# EAGLE schematic fdcanusb (EAGLE 6.5.0)
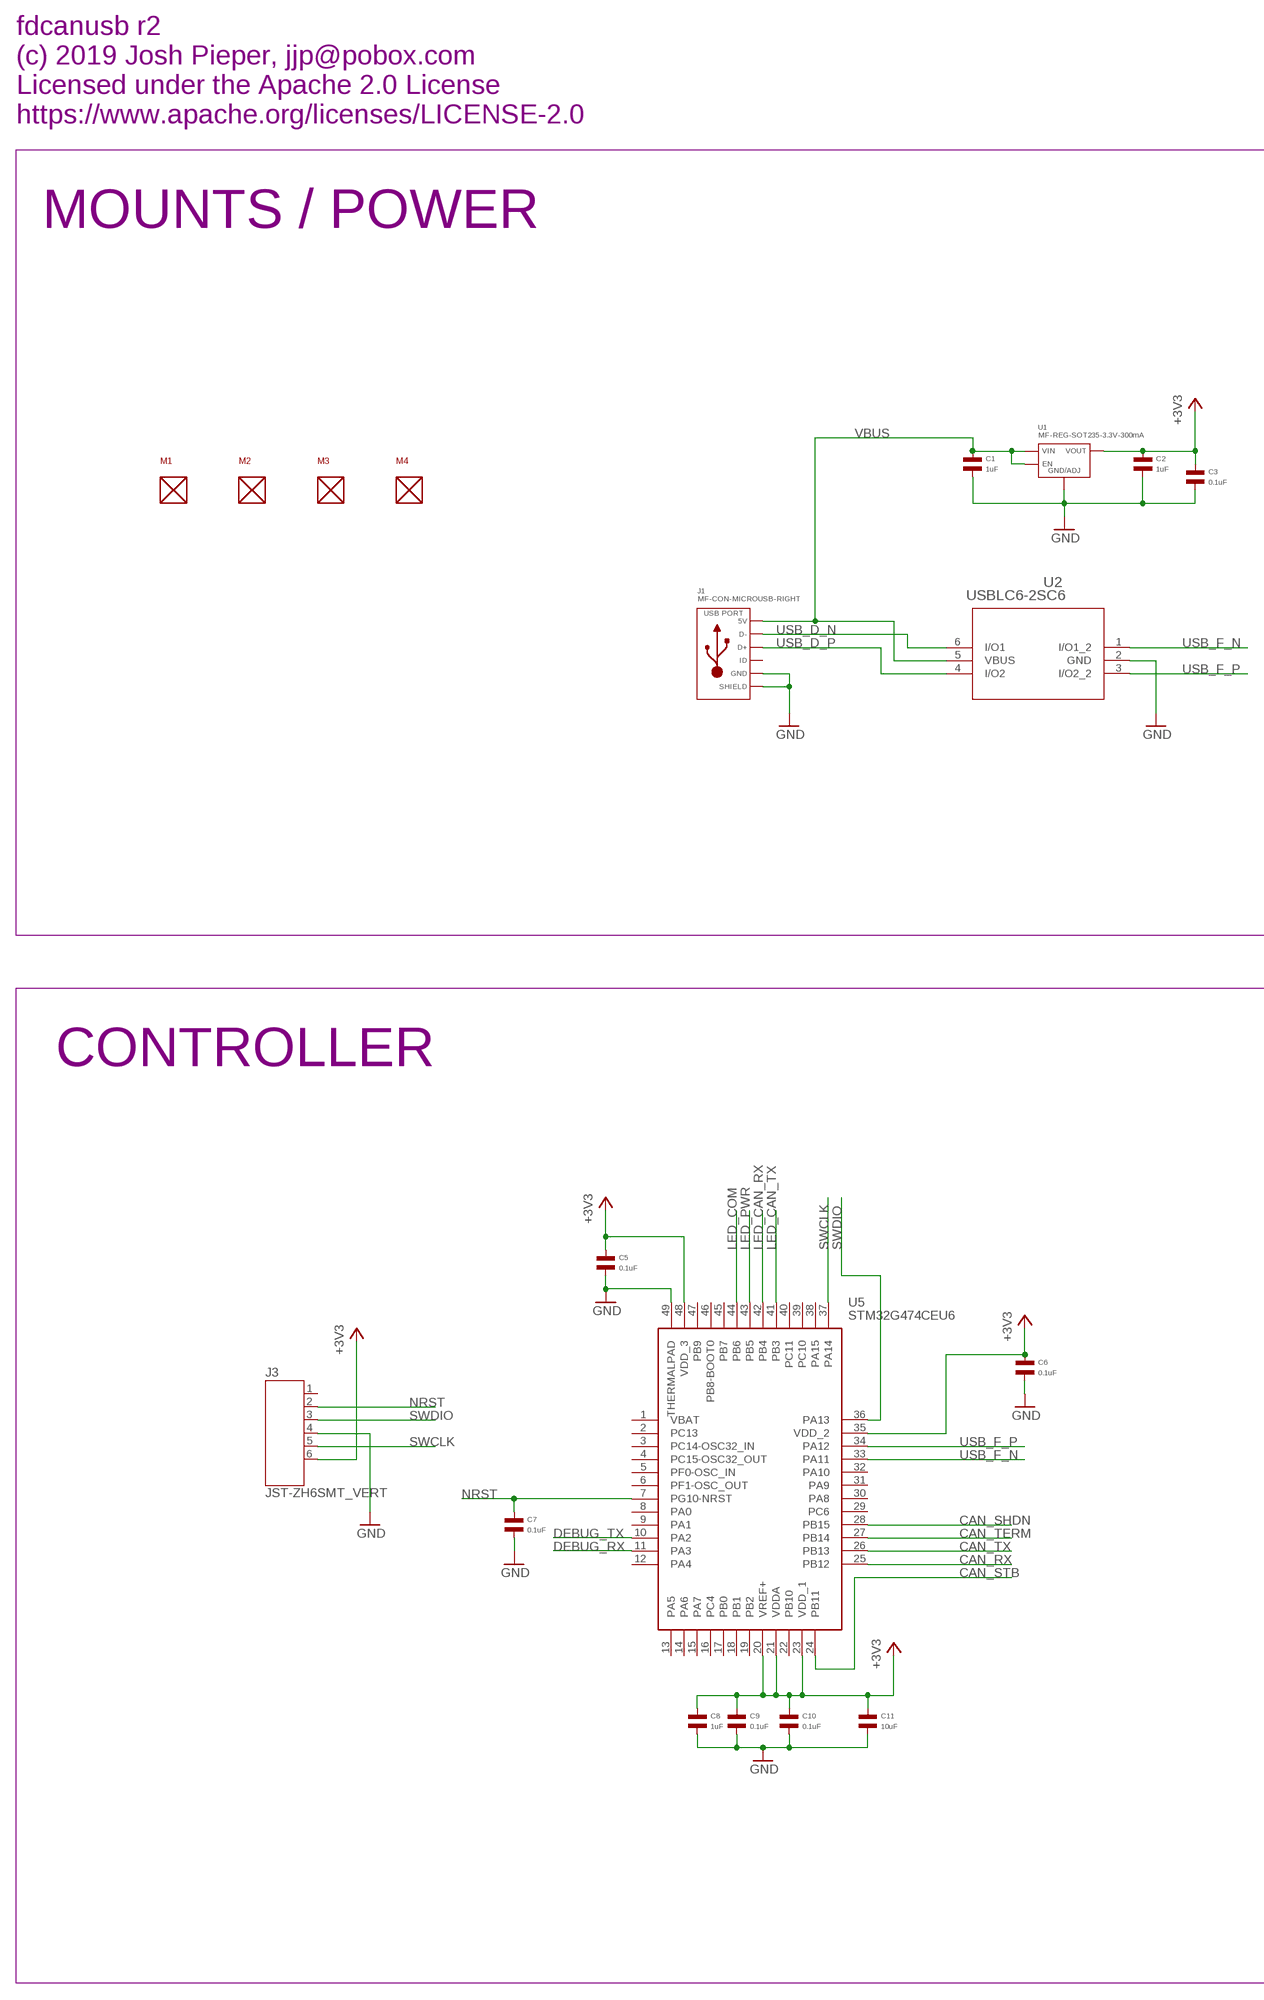
[diagram p0: schematic, sheet 1, part 1 of 2]
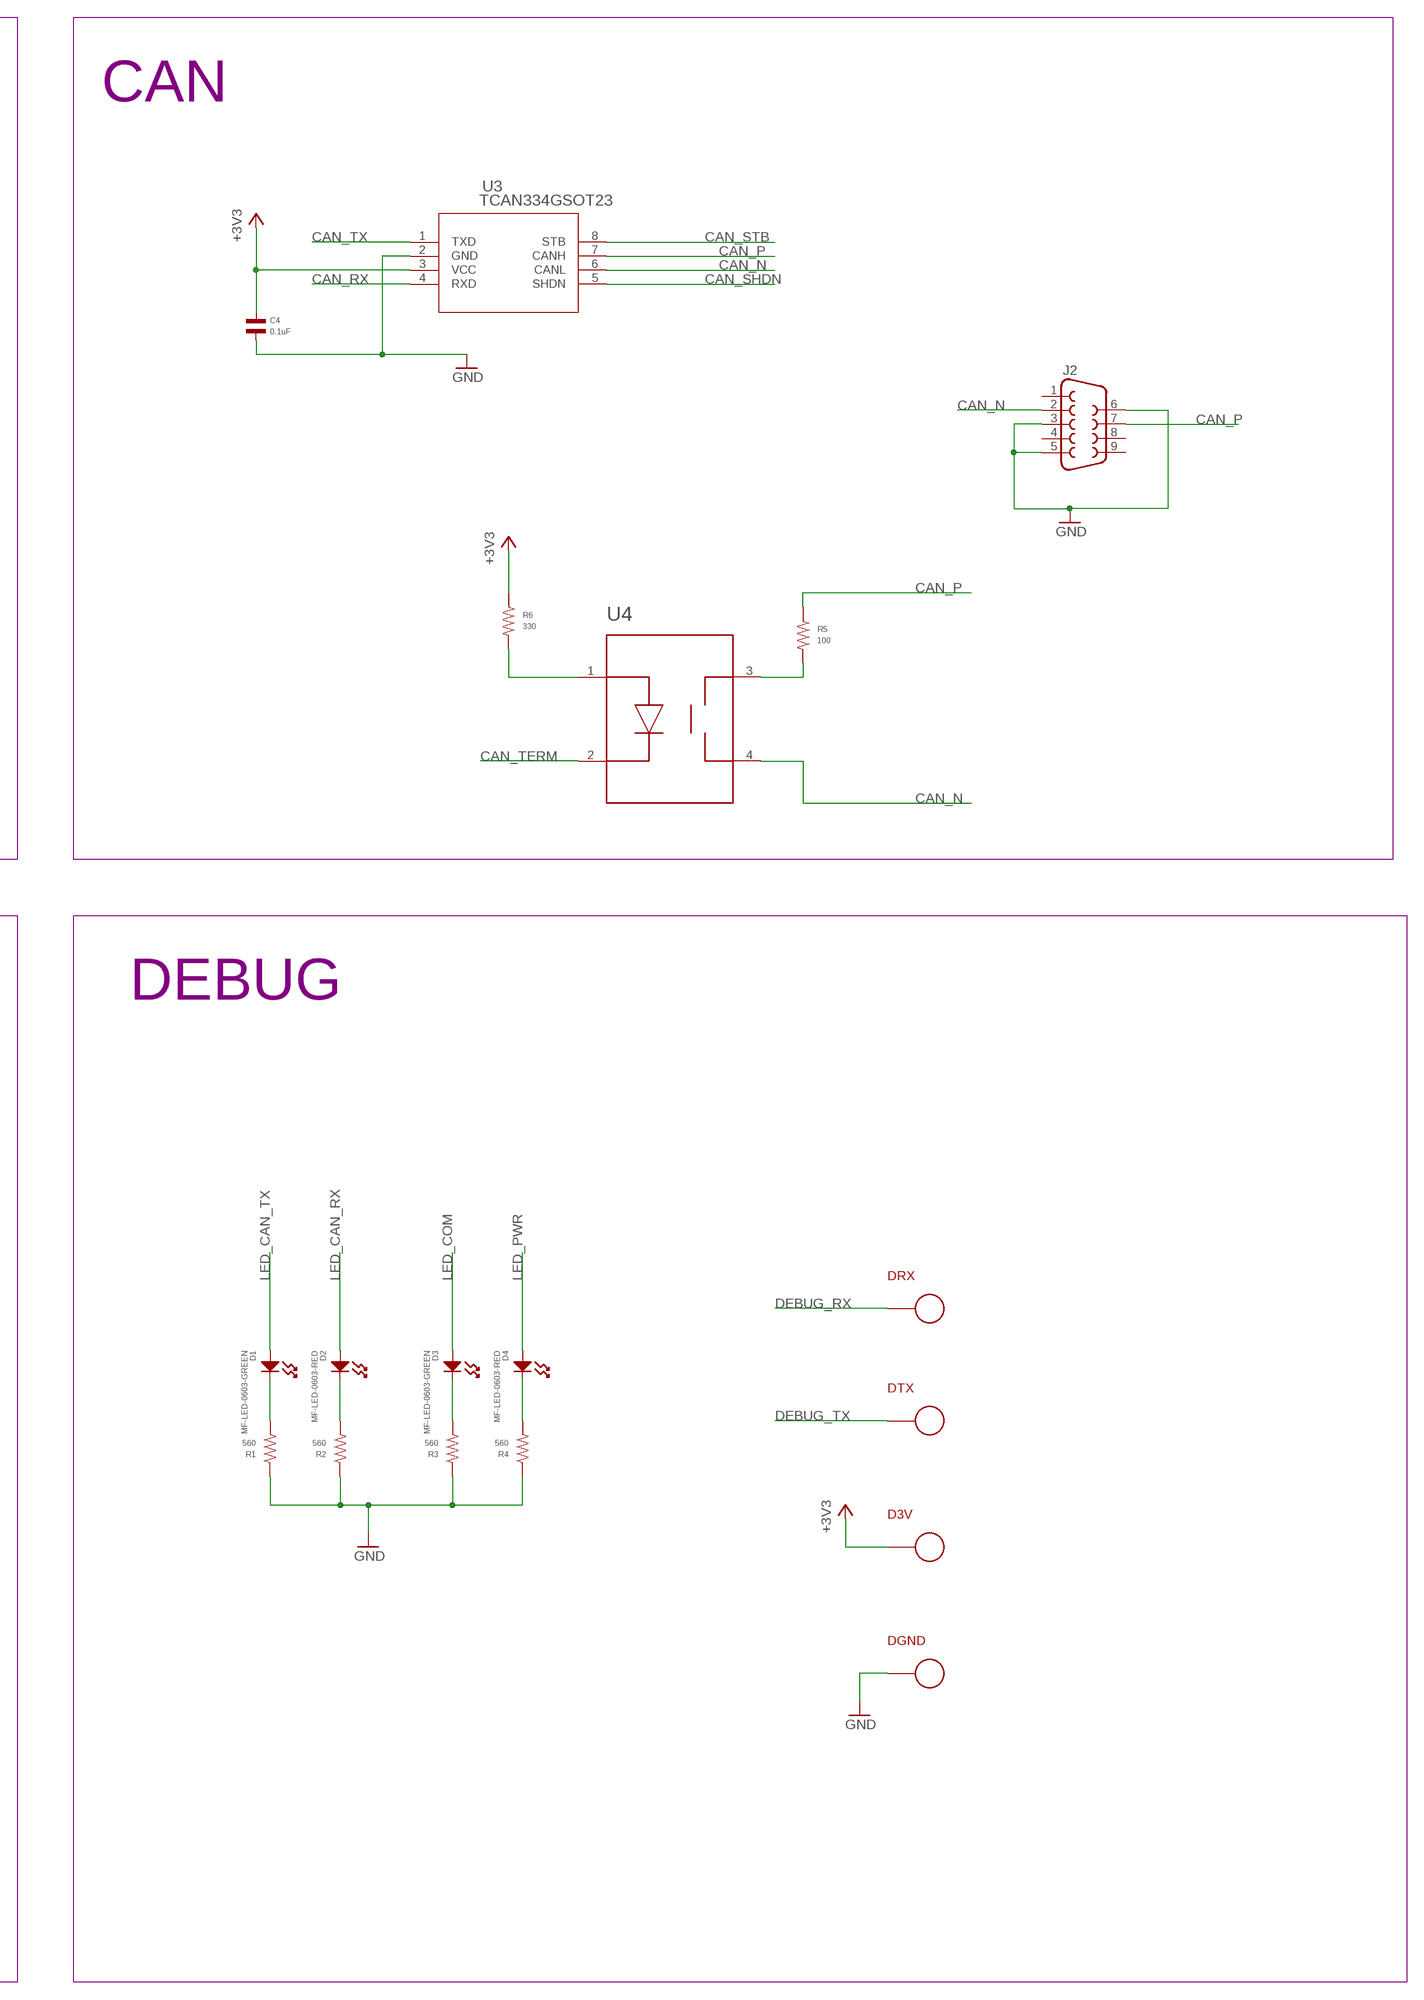
[diagram p1: schematic, sheet 1, part 2 of 2]

## Parts
C1  1uF  CAPACITOR_NP_0603  [C0603]
C2  1uF  CAPACITOR_NP_0603  [C0603]
C3  0.1uF  CAPACITOR_NP_0402  [C0402]
C4  0.1uF  CAPACITOR_NP_0402  [C0402]
C5  0.1uF  CAPACITOR_NP_0402  [C0402]
C6  0.1uF  CAPACITOR_NP_0402  [C0402]
C7  0.1uF  CAPACITOR_NP_0402  [C0402]
C8  1uF  CAPACITOR_NP_0603  [C0603]
C9  0.1uF  CAPACITOR_NP_0402  [C0402]
C10  0.1uF  CAPACITOR_NP_0402  [C0402]
C11  10uF  CAPACITOR_NP_1206  [C1206]
D1  MF-LED-0603-GREEN  LED_SINGLE-0603-GREEN  [LED0603]
D2  MF-LED-0603-RED  LED_SINGLE-0603-RED  [LED0603]
D3  MF-LED-0603-GREEN  LED_SINGLE-0603-GREEN  [LED0603]
D3V  PAD24AWG_PAD  [24AWG_PAD]
D4  MF-LED-0603-RED  LED_SINGLE-0603-RED  [LED0603]
DGND  PAD24AWG_PAD  [24AWG_PAD]
DRX  PAD24AWG_PAD  [24AWG_PAD]
DTX  PAD24AWG_PAD  [24AWG_PAD]
J1  MF-CON-MICROUSB-RIGHT  USB_MICRO_RIGHT  [MICROUSB-RIGHT]
J2  F09H  [F09H]
J3  JST-ZH6SMT_VERT  [JST_B6B-ZR-SM4-TF(LF)(SN)]
M1  MOUNT  [M2.5MOUNT]
M2  MOUNT  [M2.5MOUNT]
M3  MOUNT  [M2.5MOUNT]
M4  MOUNT  [M2.5MOUNT]
R1  560  RESISTOR_0402  [R0402]
R2  560  RESISTOR_0402  [R0402]
R3  560  RESISTOR_0402  [R0402]
R4  560  RESISTOR_0402  [R0402]
R5  100  RESISTOR_0805  [R0805]
R6  330  RESISTOR_0402  [R0402]
U1  MF-REG-SOT235-3.3V-300mA  TLV70233PDBVR  [SOT-23-5]
U2  USBLC6-2SC6  [SOT23-6L]
U3  TCAN334GSOT23  [SOT23-8]
U4  TLP3317  [TLP3317]
U5  STM32G474CEU6  [QFN50P700X700X60-49N]

## Nets
+3V3: C2.P$1 C3.P$1 C4.P$1 C5.P$1 C6.P$1 C8.P$1 C9.P$1 C10.P$1 C11.P$1 D3V.P$1 J3.6 R6.P$1 U1.P$5(VOUT) U3.3(VCC) U5.20(VREF+) U5.21(VDDA) U5.23(VDD_1) U5.35(VDD_2) U5.48(VDD_3)
CAN_N [can]: J2.2 U3.6(CANL) U4.4(SW2)
CAN_P [can]: J2.7 R5.P$1 U3.7(CANH)
CAN_RX: U3.4(RXD) U5.25(PB12)
CAN_SHDN: U3.5(SHDN) U5.28(PB15)
CAN_STB: U3.8(STB) U5.24(PB11)
CAN_TERM: U4.2(CATHODE) U5.27(PB14)
CAN_TX: U3.1(TXD) U5.26(PB13)
DEBUG_RX: DRX.P$1 U5.11(PA3)
DEBUG_TX: DTX.P$1 U5.10(PA2)
GND: C1.P$2 C2.P$2 C3.P$2 C4.P$2 C5.P$2 C6.P$2 C7.P$2 C8.P$2 C9.P$2 C10.P$2 C11.P$2 DGND.P$1 J1.5(GND) J1.S1(SLD) J1.S2(SLD) J1.S3(SLD) J1.S4(SLD) J1.S5(SLD) J1.S6(SLD) J2.3 J2.5 J2.6 J3.4 R1.P$1 R2.P$1 R3.P$1 R4.P$1 U1.P$2(GND/ADJ) U2.2(GND) U3.2(GND) U5.49(THERMALPAD)
LED_CAN_RX: D2.ANODE U5.42(PB4)
LED_CAN_TX: D1.ANODE U5.41(PB3)
LED_COM: D3.ANODE U5.44(PB6)
LED_PWR: D4.ANODE U5.43(PB5)
N$3: D1.CATHODE R1.P$2
N$4: D2.CATHODE R2.P$2
N$5: D3.CATHODE R3.P$2
N$6: D4.CATHODE R4.P$2
N$7: R5.P$2 U4.3(SW1)
N$8: R6.P$2 U4.1(ANODE)
NRST: C7.P$1 J3.2 U5.7(PG10-NRST)
SWCLK: J3.5 U5.37(PA14)
SWDIO: J3.3 U5.36(PA13)
USB_D_N [usb]: J1.2(D-) U2.6(I/O1)
USB_D_P [usb]: J1.3(D+) U2.4(I/O2)
USB_F_N [usb]: U2.1(I/O1_2) U5.33(PA11)
USB_F_P [usb]: U2.3(I/O2_2) U5.34(PA12)
VBUS: C1.P$1 J1.1(5V) U1.P$1(VIN) U1.P$3(EN) U2.5(VBUS)
Unconnected: J1.4(ID) J2.1 J2.4 J2.8 J2.9 J3.1 U5.1(VBAT) U5.2(PC13) U5.3(PC14-OSC32_IN) U5.4(PC15-OSC32_OUT) U5.5(PF0-OSC_IN) U5.6(PF1-OSC_OUT) U5.8(PA0) U5.9(PA1) U5.12(PA4) U5.13(PA5) U5.14(PA6) U5.15(PA7) U5.16(PC4) U5.17(PB0) U5.18(PB1) U5.19(PB2) U5.22(PB10) U5.29(PC6) U5.30(PA8) U5.31(PA9) U5.32(PA10) U5.38(PA15) U5.39(PC10) U5.40(PC11) U5.45(PB7) U5.46(PB8-BOOT0) U5.47(PB9)

## Notes on the sheet
- fdcanusb r2
  (c) 2019 Josh Pieper, jjp@pobox.com
  Licensed under the Apache 2.0 License
  https://www.apache.org/licenses/LICENSE-2.0
- MOUNTS / POWER | CAN
- CONTROLLER | DEBUG

## Library data of the parts
C1 C2 C8 = mfpassives:CAPACITOR_NP: Library: MF_Passives Description: Device for Non-Polarized Capacitors. Manufacture part number (MPN) can be added via Attributes. Check https://factory.macrofab.com/parts for the house parts list.; HOUSEPART: YES; MPN: MF-CAP-0603-1uF; POPULATE: 1
C3-C7 C9 C10 = mfpassives:CAPACITOR_NP: Library: MF_Passives Description: Device for Non-Polarized Capacitors. Manufacture part number (MPN) can be added via Attributes. Check https://factory.macrofab.com/parts for the house parts list.; HOUSEPART: YES; MPN: MF-CAP-0402-0.1uF; POPULATE: 1
C11 = mfpassives:CAPACITOR_NP: Library: MF_Passives Description: Device for Non-Polarized Capacitors. Manufacture part number (MPN) can be added via Attributes. Check https://factory.macrofab.com/parts for the house parts list.; HOUSEPART: YES; MPN: MF-CAP-1206-10uF; POPULATE: 1
D1 D3 = mfleds:LED_SINGLE: Library: MF_LEDs Description: Device for Single LED Packages. Manufacture part number (MFG#) can be added via Attributes.; HOUSEPART: YES; MPN: MF-LED-0603-GREEN; POPULATE: 1; URL: https://factory.macrofab.com/part/MF-LED-0603-GREEN
D2 D4 = mfleds:LED_SINGLE: Library: MF_LEDs Description: Device for Single LED Packages. Manufacture part number (MFG#) can be added via Attributes.; HOUSEPART: YES; MPN: MF-LED-0603-RED; POPULATE: 1; URL: https://factory.macrofab.com/part/MF-LED-0603-RED
D3V DGND DRX DTX = fdcanusb:PAD; POPULATE: 0
J1 = mfconnectors:USB: Library: MF_Connectors Description: 5 Pin USB Connectors. SLD is the shield connection. Usually tied to ground through a small ferrite bead.; HOUSEPART: YES; MPN: MF-CON-MICROUSB-RIGHT; POPULATE: 1; URL: https://factory.macrofab.com/part/MF-CON-MICROUSB-RIGHT
J2 = fdcanusb:F09: SUB-D; MF: Assmann WSW Components; MPN: AE10968-ND; OC_FARNELL: unknown; OC_NEWARK: unknown; POPULATE: 1
J3 = fdcanusb:JST-ZH6; MF: JST; MPN: B6B-ZR-SM4-TF(LF)(SN); POPULATE: 1
M1-M4 = fdcanusb:MOUNT; POPULATE: 0
R1-R4 = mfpassives:RESISTOR: Library: MF_Passives Description: Device for Resistors. Manufacture part number (MPN), Voltage, Tolerance, and Wattage Rating can be added via Attributes. Check https://factory.macrofab.com/parts for the house parts list.; MPN: MF-RES-0402-560; POPULATE: 1
R5 = mfpassives:RESISTOR: Library: MF_Passives Description: Device for Resistors. Manufacture part number (MPN), Voltage, Tolerance, and Wattage Rating can be added via Attributes. Check https://factory.macrofab.com/parts for the house parts list.; MPN: MF-RES-0805-100; POPULATE: 1
R6 = mfpassives:RESISTOR: Library: MF_Passives Description: Device for Resistors. Manufacture part number (MPN), Voltage, Tolerance, and Wattage Rating can be added via Attributes. Check https://factory.macrofab.com/parts for the house parts list.; MPN: MF-RES-0402-330; POPULATE: 1
U1 = mficpower:TLV702: Manufacturer Part #: TLV702 Manufacturer: Texas Instruments Description: LDO Voltage Regulators; HOUSEPART: YES; MPN: MF-REG-SOT235-3.3V-300mA; POPULATE: 1; URL: https://factory.macrofab.com/part/MF-REG-SOT235-3.3V-300mA
U2 = fdcanusb:USBLC6-2SC6; MANUFACTURER_PART_NUMBER: USBLC62SC6; MF: ST; MPN: USBLC6-2SC6; POPULATE: 1; VENDOR: STMicroelectronics
U3 = fdcanusb:TCAN334G; MF: TI; MPN: TCAN334GDCNT; POPULATE: 1
U4 = fdcanusb:TLP3317; MF: TOSHIBA; MPN: TLP3317; POPULATE: 1
U5 = fdcanusb:STM32G474CEU6: STMICROELECTRONICS - STM32G474CEU6 - MCU, 32BIT, 170MHZ, UFQFPN-48 Source: Datasheet <https://componentsearchengine.com/Datasheets/1/STM32G474CEU6.pdf>; DESCRIPTION: STMICROELECTRONICS - STM32G474CEU6 - MCU, 32BIT, 170MHZ, UFQFPN-48; HEIGHT: 0.6mm; MANUFACTURER_NAME: STMicroelectronics; MANUFACTURER_PART_NUMBER: STM32G474CEU6; MF: ST; MOUSER_PART_NUMBER: 511-STM32G474CEU6; MOUSER_PRICE-STOCK: https://www.mouser.com/Search/Refine.aspx?Keyword=511-STM32G474CEU6; MPN: STM32G474CEU6; POPULATE: 1

## Net classes
1 usb: width 0.305 mm, clearance 0.127 mm
2 can: width 0.216 mm, clearance 0.127 mm